# EAGLE schematic *ProtoBoard (EAGLE 7.2.0)
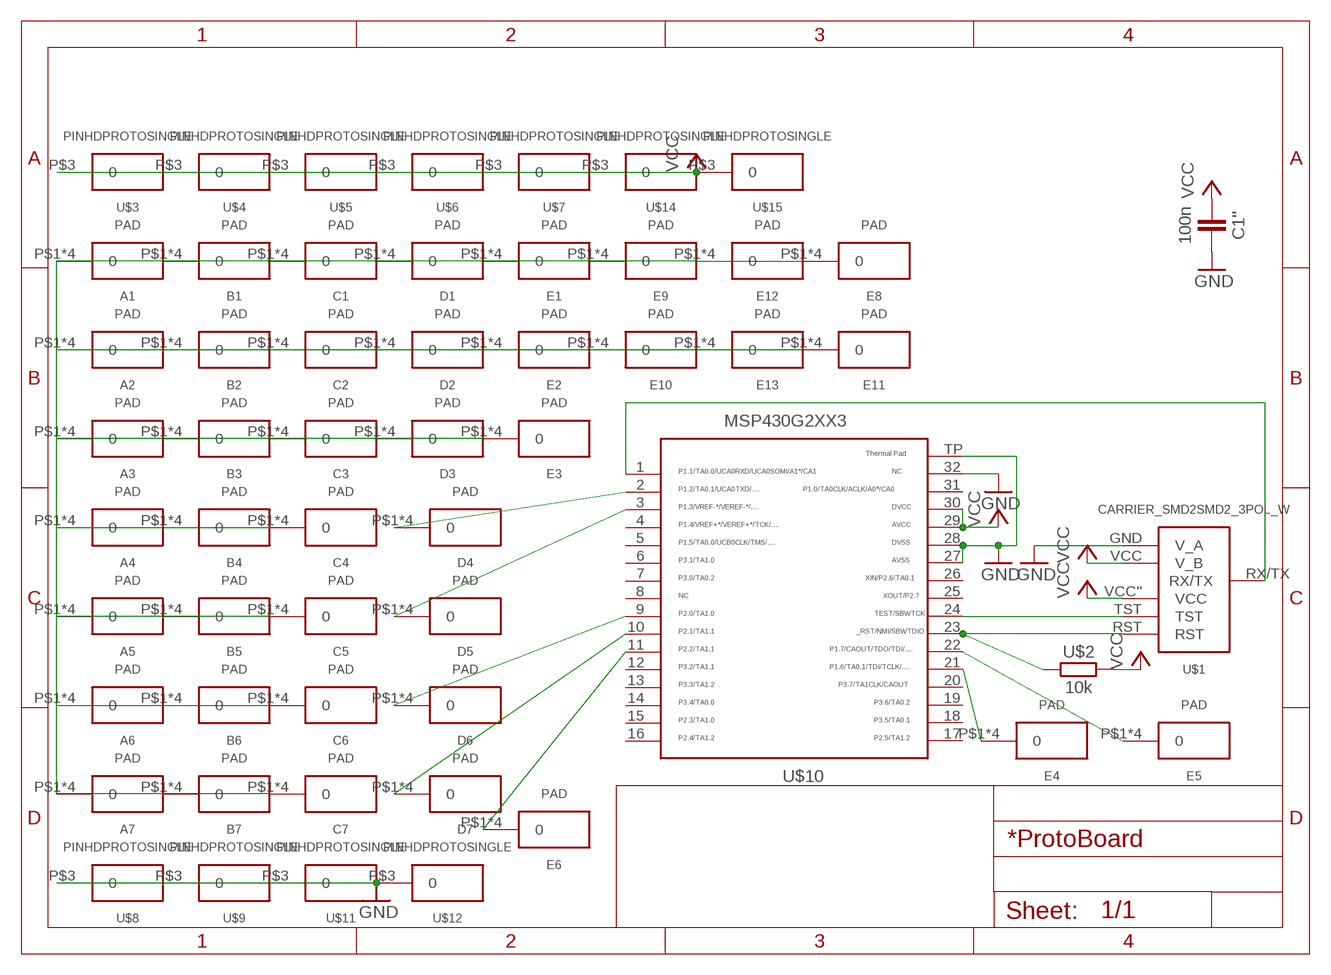
[diagram p0: schematic, sheet 1]

## Parts
A1  PAD  PINHDPROTOTYPING  [PROTPAD]
A2  PAD  PINHDPROTOTYPING  [PROTPAD]
A3  PAD  PINHDPROTOTYPING  [PROTPAD]
A4  PAD  PINHDPROTOTYPING  [PROTPAD]
A5  PAD  PINHDPROTOTYPING  [PROTPAD]
A6  PAD  PINHDPROTOTYPING  [PROTPAD]
A7  PAD  PINHDPROTOTYPING  [PROTPAD]
B1  PAD  PINHDPROTOTYPING  [PROTPAD]
B2  PAD  PINHDPROTOTYPING  [PROTPAD]
B3  PAD  PINHDPROTOTYPING  [PROTPAD]
B4  PAD  PINHDPROTOTYPING  [PROTPAD]
B5  PAD  PINHDPROTOTYPING  [PROTPAD]
B6  PAD  PINHDPROTOTYPING  [PROTPAD]
B7  PAD  PINHDPROTOTYPING  [PROTPAD]
C1  PAD  PINHDPROTOTYPING  [PROTPAD]
C1''  100n  CAPACITOR  [603]
C2  PAD  PINHDPROTOTYPING  [PROTPAD]
C3  PAD  PINHDPROTOTYPING  [PROTPAD]
C4  PAD  PINHDPROTOTYPING  [PROTPAD]
C5  PAD  PINHDPROTOTYPING  [PROTPAD]
C6  PAD  PINHDPROTOTYPING  [PROTPAD]
C7  PAD  PINHDPROTOTYPING  [PROTPAD]
D1  PAD  PINHDPROTOTYPING  [PROTPAD]
D2  PAD  PINHDPROTOTYPING  [PROTPAD]
D3  PAD  PINHDPROTOTYPING  [PROTPAD]
D4  PAD  PINHDPROTOTYPING  [PROTPAD]
D5  PAD  PINHDPROTOTYPING  [PROTPAD]
D6  PAD  PINHDPROTOTYPING  [PROTPAD]
D7  PAD  PINHDPROTOTYPING  [PROTPAD]
E1  PAD  PINHDPROTOTYPING  [PROTPAD]
E2  PAD  PINHDPROTOTYPING  [PROTPAD]
E3  PAD  PINHDPROTOTYPING  [PROTPAD]
E4  PAD  PINHDPROTOTYPING  [PROTPAD]
E5  PAD  PINHDPROTOTYPING  [PROTPAD]
E6  PAD  PINHDPROTOTYPING  [PROTPAD]
E8  PAD  PINHDPROTOTYPING  [PROTPAD]
E9  PAD  PINHDPROTOTYPING  [PROTPAD]
E10  PAD  PINHDPROTOTYPING  [PROTPAD]
E11  PAD  PINHDPROTOTYPING  [PROTPAD]
E12  PAD  PINHDPROTOTYPING  [PROTPAD]
E13  PAD  PINHDPROTOTYPING  [PROTPAD]
U$1  CARRIER_SMD2SMD2_3POL_W  [CARRIER_SMD2_WIDE_3POL]
U$2  10k  RESISTOR0603  [603]
U$3  PINHDPROTOSINGLE  [PROTOPADSINGLE]
U$4  PINHDPROTOSINGLE  [PROTOPADSINGLE]
U$5  PINHDPROTOSINGLE  [PROTOPADSINGLE]
U$6  PINHDPROTOSINGLE  [PROTOPADSINGLE]
U$7  PINHDPROTOSINGLE  [PROTOPADSINGLE]
U$8  PINHDPROTOSINGLE  [PROTOPADSINGLE]
U$9  PINHDPROTOSINGLE  [PROTOPADSINGLE]
U$10  MSP430G2553  [QFN32]
U$11  PINHDPROTOSINGLE  [PROTOPADSINGLE]
U$12  PINHDPROTOSINGLE  [PROTOPADSINGLE]
U$14  PINHDPROTOSINGLE  [PROTOPADSINGLE]
U$15  PINHDPROTOSINGLE  [PROTOPADSINGLE]

## Nets
GND: C1''.2 U$1.GND(V_A) U$8.P$3 U$9.P$3 U$10.27 U$10.28 U$10.32 U$10.TP U$11.P$3 U$12.P$3
N$2: A1.P$1 A1.P$2 A1.P$3 A1.P$4 A2.P$1 A2.P$2 A2.P$3 A2.P$4 A3.P$1 A3.P$2 A3.P$3 A3.P$4 A4.P$1 A4.P$2 A4.P$3 A4.P$4 A5.P$1 A5.P$2 A5.P$3 A5.P$4 A6.P$1 A6.P$2 A6.P$3 A6.P$4 A7.P$1 A7.P$2 A7.P$3 A7.P$4 B1.P$1 B1.P$2 B1.P$3 B1.P$4 B2.P$1 B2.P$2 B2.P$3 B2.P$4 B3.P$1 B3.P$2 B3.P$3 B3.P$4 B4.P$1 B4.P$2 B4.P$3 B4.P$4 B5.P$1 B5.P$2 B5.P$3 B5.P$4 B6.P$1 B6.P$2 B6.P$3 B6.P$4 B7.P$1 B7.P$2 B7.P$3 B7.P$4 C1.P$1 C1.P$2 C1.P$3 C1.P$4 C2.P$1 C2.P$2 C2.P$3 C2.P$4 C3.P$1 C3.P$2 C3.P$3 C3.P$4 C4.P$1 C4.P$2 C4.P$3 C4.P$4 C5.P$1 C5.P$2 C5.P$3 C5.P$4 C6.P$1 C6.P$2 C6.P$3 C6.P$4 C7.P$1 C7.P$2 C7.P$3 C7.P$4 D1.P$1 D1.P$2 D1.P$3 D1.P$4 D2.P$1 D2.P$2 D2.P$3 D2.P$4 D3.P$1 D3.P$2 D3.P$3 D3.P$4 E1.P$1 E1.P$2 E1.P$3 E1.P$4 E2.P$1 E2.P$2 E2.P$3 E2.P$4 E3.P$1 E3.P$2 E3.P$3 E3.P$4 E8.P$1 E8.P$2 E8.P$3 E8.P$4 E9.P$1 E9.P$2 E9.P$3 E9.P$4 E10.P$1 E10.P$2 E10.P$3 E10.P$4 E11.P$1 E11.P$2 E11.P$3 E11.P$4 E12.P$1 E12.P$2 E12.P$3 E12.P$4 E13.P$1 E13.P$2 E13.P$3 E13.P$4
N$3: U$1.TST U$10.24
N$4: U$1.RST U$2.1 U$10.23
N$5: D4.P$1 D4.P$2 D4.P$3 D4.P$4 U$10.2
N$6: D5.P$1 D5.P$2 D5.P$3 D5.P$4 U$10.3
N$7: E5.P$1 E5.P$2 E5.P$3 E5.P$4 U$10.22
N$11: E4.P$1 E4.P$2 E4.P$3 E4.P$4 U$10.21
N$12: U$1.RX/TX U$10.1
N$13: D6.P$1 D6.P$2 D6.P$3 D6.P$4 U$10.9
N$14: D7.P$1 D7.P$2 D7.P$3 D7.P$4 U$10.10
N$16: E6.P$1 E6.P$2 E6.P$3 E6.P$4 U$10.11
VCC: C1''.1 U$1.VCC''(VCC) U$1.VCC(V_B) U$2.2 U$3.P$3 U$4.P$3 U$5.P$3 U$6.P$3 U$7.P$3 U$10.29 U$10.30 U$14.P$3 U$15.P$3
Unconnected: U$10.4 U$10.5 U$10.6 U$10.7 U$10.8 U$10.12 U$10.13 U$10.14 U$10.15 U$10.16 U$10.17 U$10.18 U$10.19 U$10.20 U$10.25 U$10.26 U$10.31

## Library data of the parts
A1-A7 B1-B7 C1-C7 D1-D7 E1-E6 E8-E13 U$3-U$9 U$11 U$12 U$14 U$15 = thar:PINHD: ...DIY...
C1'' = thar:CAPACITOR
U$1 = thar:CARRIER_SMD2
U$2 = thar:RESISTOR
U$10 = thar:MSP430G2553: TEXAS INSTRUMENTS MSP430G2553IRHB32R MCU, 16BIT, MSP430, 16MHZ, QFN-32 Farnell Best.Nr.: 2325726 Herst.Bez.: MSP430G2553IRHB32R